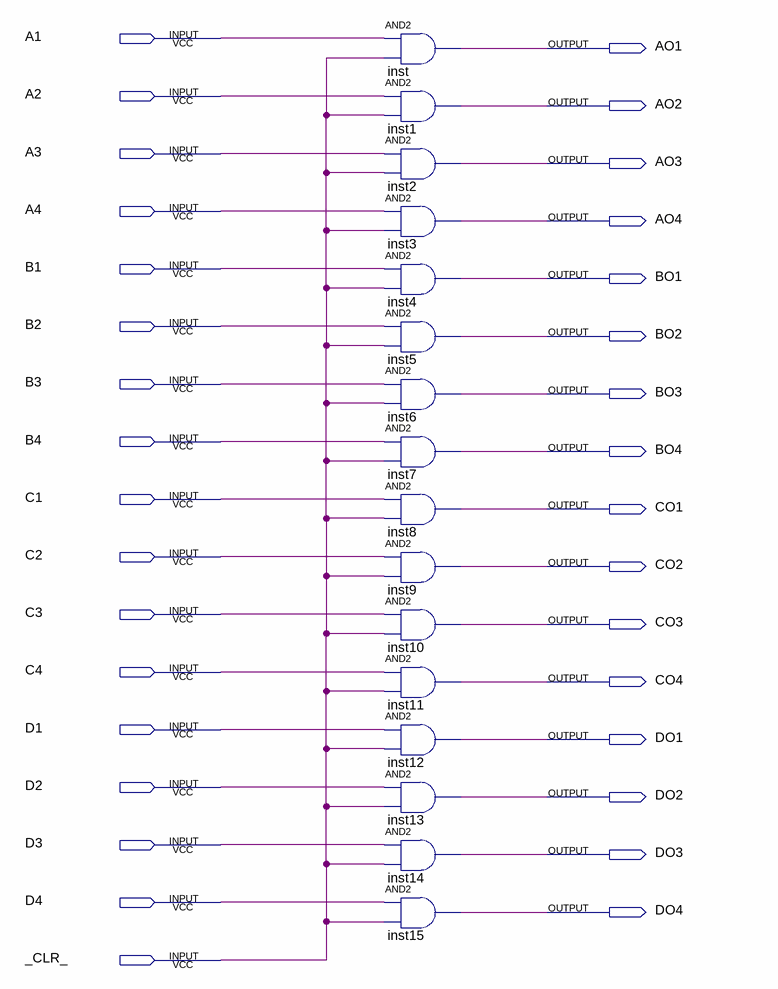
[diagram p0: schematic sheet]
// Quartus schematic clear.bdf as structural Verilog: 16 symbols, 33 pins
module clear (
  input  A1,
  input  A2,
  input  A3,
  input  A4,
  input  B1,
  input  B2,
  input  B3,
  input  B4,
  input  C1,
  input  C2,
  input  C3,
  input  C4,
  input  D1,
  input  D2,
  input  D3,
  input  D4,
  input  _CLR_,
  output AO1,
  output AO2,
  output AO3,
  output AO4,
  output BO1,
  output BO2,
  output BO3,
  output BO4,
  output CO1,
  output CO2,
  output CO3,
  output CO4,
  output DO1,
  output DO2,
  output DO3,
  output DO4
);

  and inst (AO1, A1, _CLR_);
  and inst1 (AO2, A2, _CLR_);
  and inst2 (AO3, A3, _CLR_);
  and inst3 (AO4, A4, _CLR_);
  and inst4 (BO1, B1, _CLR_);
  and inst5 (BO2, B2, _CLR_);
  and inst6 (BO3, B3, _CLR_);
  and inst7 (BO4, B4, _CLR_);
  and inst8 (CO1, C1, _CLR_);
  and inst9 (CO2, C2, _CLR_);
  and inst10 (CO3, C3, _CLR_);
  and inst11 (CO4, C4, _CLR_);
  and inst12 (DO1, D1, _CLR_);
  and inst13 (DO2, D2, _CLR_);
  and inst14 (DO3, D3, _CLR_);
  and inst15 (DO4, D4, _CLR_);
endmodule
